# EAGLE design alimentadorV2 (EAGLE 6.6.0)
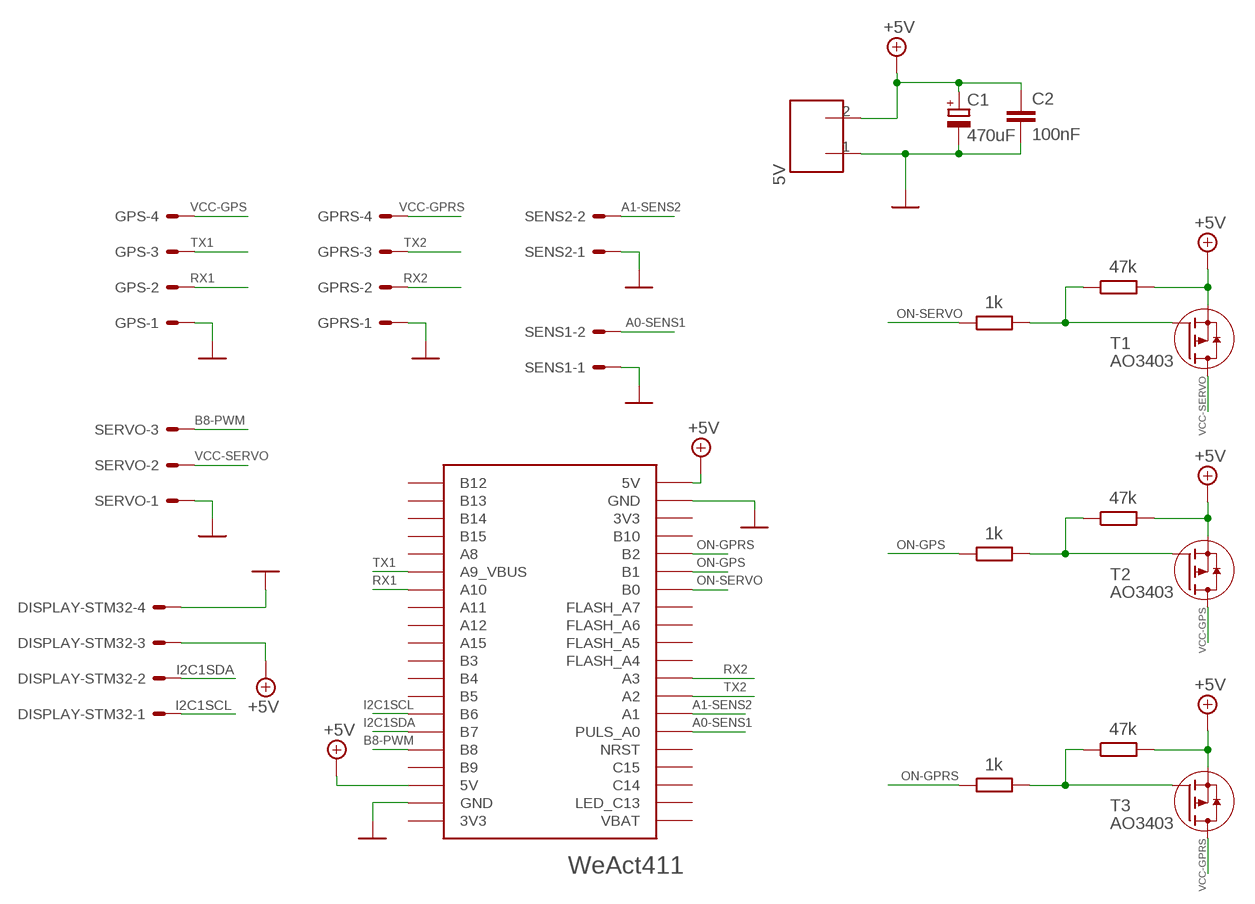
[diagram p0: schematic, sheet 1]

## Parts
5V  CONECTOR_2P-3.81  [CON2P-3.81]
C1  470uF  CPOL-EUE5-10.5  [E5-10,5]
C2  100nF  C-EUC1206  [C1206]
DISPLAY-STM32  22-05-7048-04  [7395-04]
GPRS  22-27-2041-04  [6410-04]
GPS  22-27-2041-04  [6410-04]
R1  47k  R-EU_R1206  [R1206]
R2  47k  R-EU_R1206  [R1206]
R3  1k  R-EU_R1206  [R1206]
R4  1k  R-EU_R1206  [R1206]
R5  47k  R-EU_R1206  [R1206]
R6  1k  R-EU_R1206  [R1206]
SENS1  22-27-2021-02  [6410-02]
SENS2  22-27-2021-02  [6410-02]
SERVO  22-27-2031-03  [6410-03]
T1  AO3403  [SOT23]
T2  AO3403  [SOT23]
T3  AO3403  [SOT23]
U$2  WEACT411  [WEACT411]

## Nets
+5V: 5V.2 C1.+ C2.1 DISPLAY-STM32.3 R1.2 R2.2 R5.2 T1.2(S) T2.2(S) T3.2(S) U$2.5V@1(5V) U$2.5V@2(5V)
A0-SENS1: SENS1.2 U$2.A0(PULS_A0)
A1-SENS2: SENS2.2 U$2.A1
B8-PWM: SERVO.3 U$2.B8
GND [pwr]: 5V.1 C1.- C2.2 DISPLAY-STM32.4 GPRS.1 GPS.1 SENS1.1 SENS2.1 SERVO.1 U$2.GND@1(GND) U$2.GND@2(GND)
I2C1SCL: DISPLAY-STM32.1 U$2.B6
I2C1SDA: DISPLAY-STM32.2 U$2.B7
N$2: R2.1 R3.2 T1.1(G)
N$5: R1.1 R4.2 T2.1(G)
N$8: R5.1 R6.2 T3.1(G)
ON-GPRS: R6.1 U$2.B2
ON-GPS: R4.1 U$2.B1
ON-SERVO: R3.1 U$2.B0
RX1: GPS.2 U$2.A10
RX2: GPRS.2 U$2.A3
TX1: GPS.3 U$2.A9(A9_VBUS)
TX2: GPRS.3 U$2.A2
VCC-GPRS: GPRS.4 T3.3(D)
VCC-GPS: GPS.4 T2.3(D)
VCC-SERVO: SERVO.2 T1.3(D)
Unconnected: U$2.3V3@1(3V3) U$2.3V3@2(3V3) U$2.A4(FLASH_A4) U$2.A5(FLASH_A5) U$2.A6(FLASH_A6) U$2.A7(FLASH_A7) U$2.A8 U$2.A11 U$2.A12 U$2.A15 U$2.B3 U$2.B4 U$2.B5 U$2.B9 U$2.B10 U$2.B12 U$2.B13 U$2.B14 U$2.B15 U$2.C13(LED_C13) U$2.C14 U$2.C15 U$2.NRST U$2.VBAT

## Library data of the parts
5V = jcf:CONECTOR_2P-3.81
C1 = rcl:CPOL-EU: POLARIZED CAPACITOR, European symbol
C2 = rcl:C-EU: CAPACITOR, European symbol
DISPLAY-STM32 GPRS GPS = con-molex:22-?-04: CONNECTOR wire to board 2.54 mm (.1 inch) pitch header; OC_FARNELL: unknown; OC_NEWARK: unknown
R1-R6 = rcl:R-EU_: RESISTOR, European symbol
SENS1 SENS2 = con-molex:22-?-02: CONNECTOR wire to board 2.54 mm (.1 inch) pitch header; OC_FARNELL: unknown; OC_NEWARK: unknown
SERVO = con-molex:22-?-03: CONNECTOR wire to board 2.54 mm (.1 inch) pitch header; OC_FARNELL: unknown; OC_NEWARK: unknown
T1-T3 = jcf:AO3403: AO3403 P-channel MOSFET 2.6A 30V
U$2 = jcf:WEACT411: WeAct STM32F411

## Net classes
0 default: width 0.241 mm, drill 0.584 mm, clearance 0.241 mm
1 pwr: width 0.25 mm

## Board
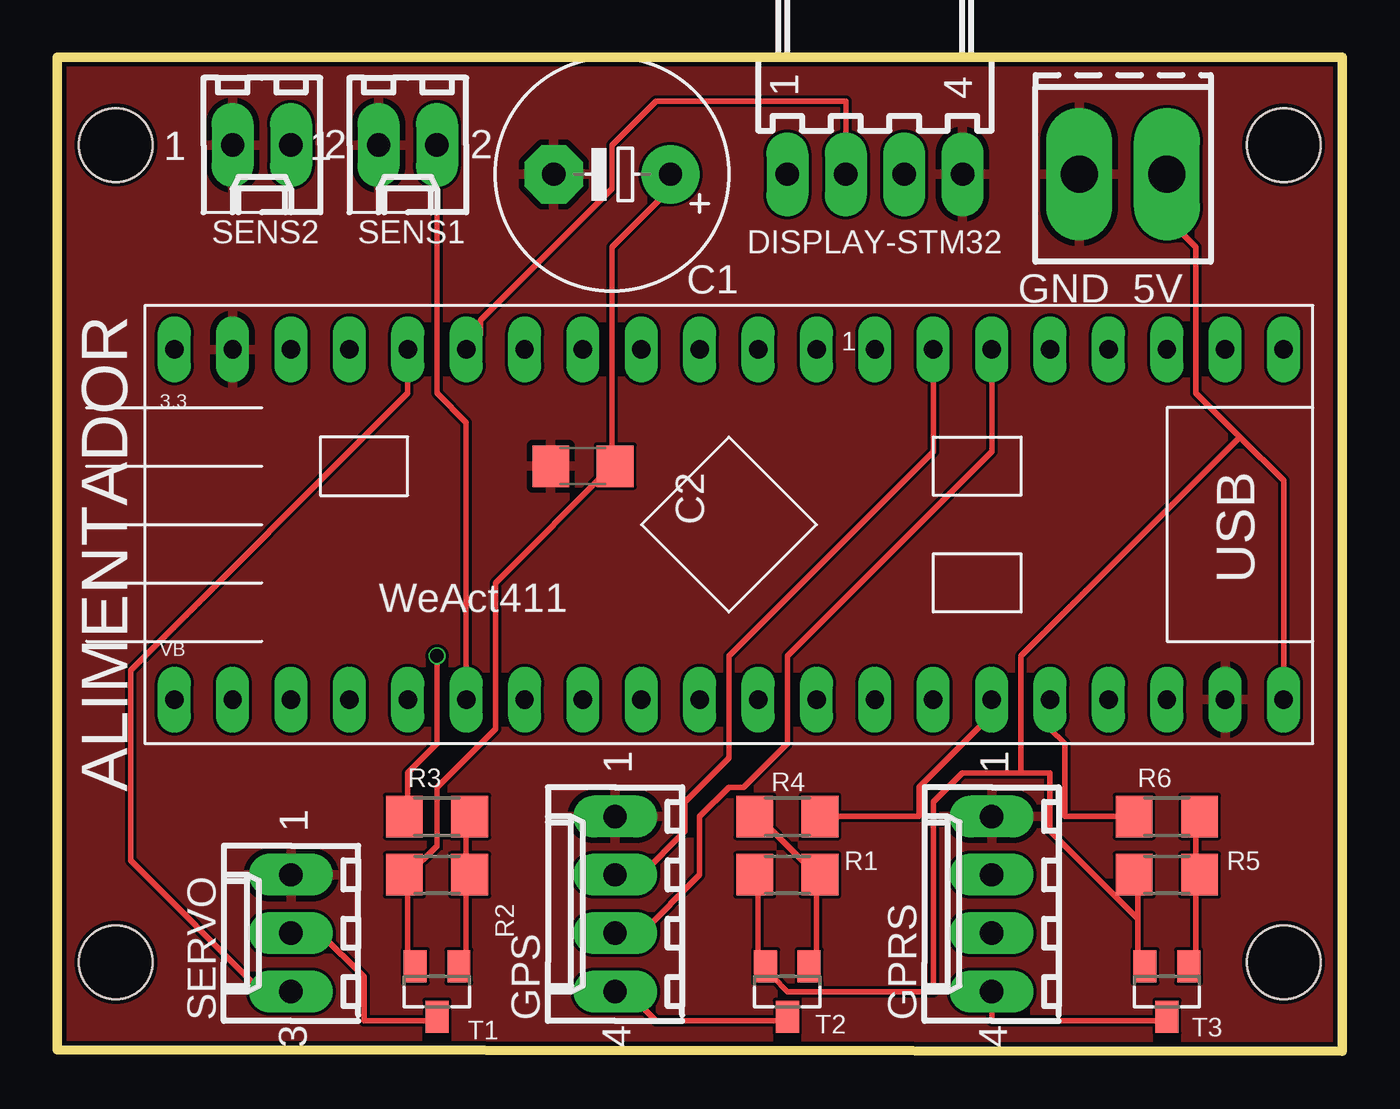
[diagram p1: board, top side]
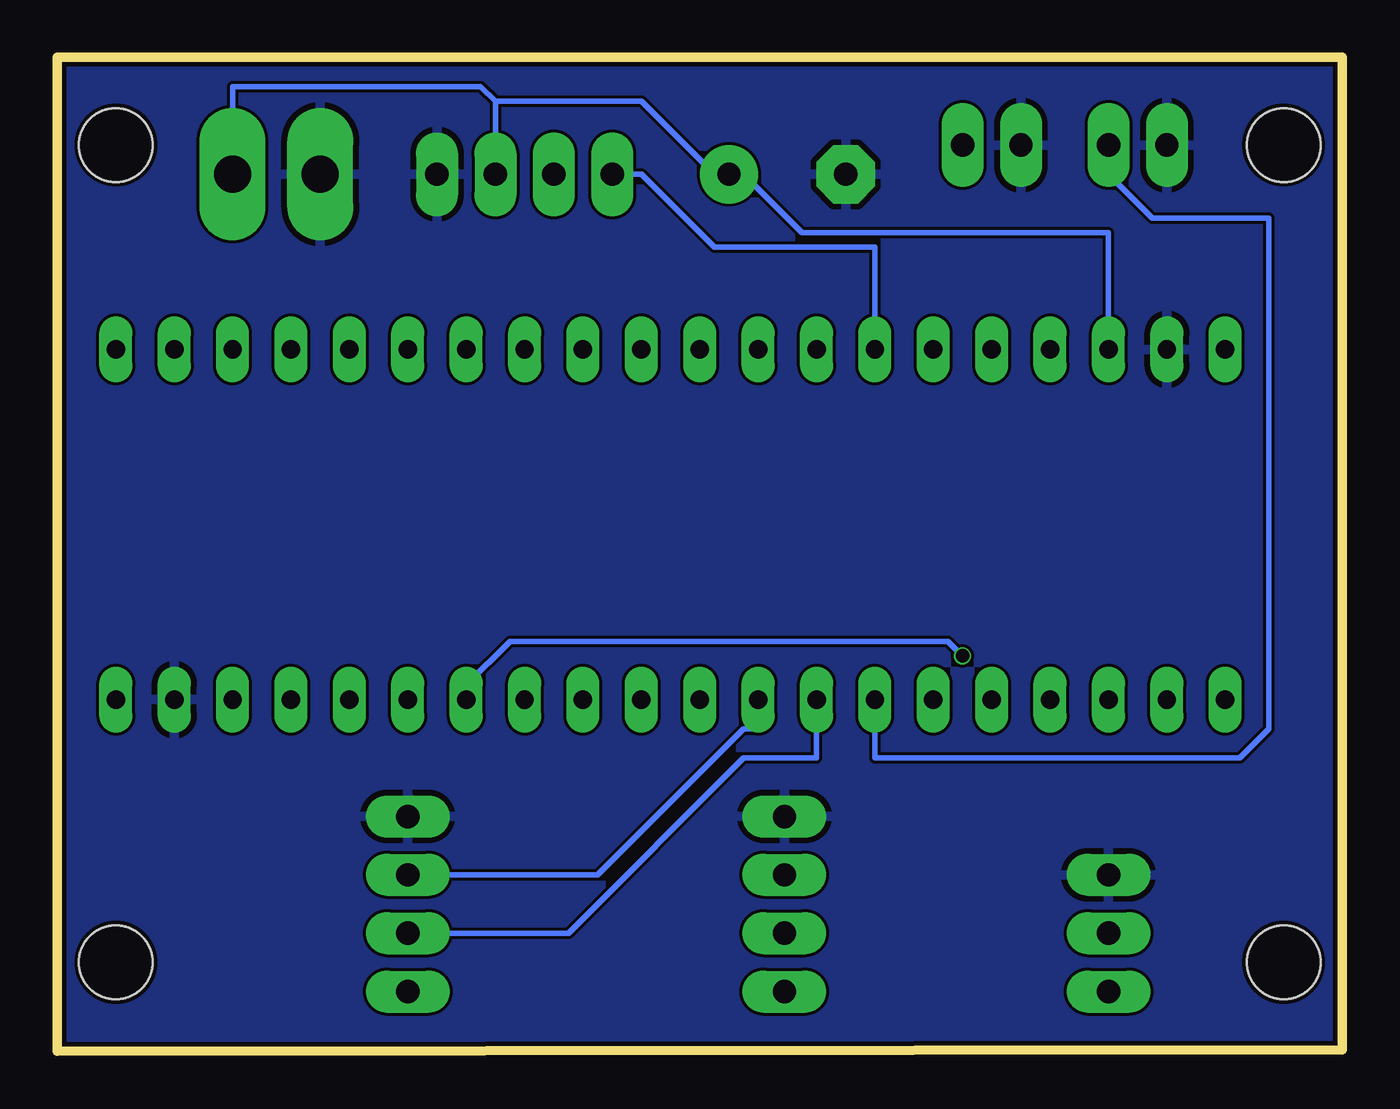
[diagram p2: board, bottom side, seen from below]

Size 55.88 x 43.23 mm. Coordinates in mm from the lower left corner, seen from the top.
Outline: 0,43.23 0,0.05 55.88,0 55.88,43.23 0,43.23
Copper layers (1*16): Top 0.035mm / dielectric 1.6mm / Bottom 0.035mm
Design rules "jlcpcb-2layers": minimum track width 5mil, minimum drill 0.3mm, track to track 5mil, track to pad 5mil, pad to pad 5mil, via to via 5mil, smd to smd 5mil, copper to edge 0.2mm, drill to drill 6mil, minimum pad ring 10mil, minimum via ring 3mil, stop-mask expansion 4mil, vias tented up to drill 0mil, thermal gap 10mil
Holes 3.2 mm at 53.34,3.86 2.54,3.86 53.34,39.42 2.54,39.42

### Footprints (pad centres in the part's own frame; a part is rotated, then mirrored left to right if it is on the bottom)
CON2P-3.81 = drill 1.6 long: 1 0,0; 2 3.81,0
E5-10,5 = drill 1.016 pad 2.54: + -2.54,0 | drill 1.016 pad 2.54 octagon: - 2.54,0
C1206 = smd 1.6 x 1.8: 1 -1.4,0; 2 1.4,0
7395-04 = drill 1.016 long: 1 3.81,0; 2 1.27,0; 3 -1.27,0; 4 -3.81,0
6410-04 = drill 1.016 long: 1 3.81,0; 2 1.27,0; 3 -1.27,0; 4 -3.81,0
R1206 = smd 1.6 x 1.803: 1 -1.422,0; 2 1.422,0
6410-02 = drill 1.016 long: 1 1.27,0; 2 -1.27,0
6410-03 = drill 1.016 long: 1 2.54,0; 2 0,0; 3 -2.54,0
SOT23 = smd 1 x 1.4: 1 -0.95,-1.1; 2 0.95,-1.1; 3 0,1.1
WEACT411 = drill 0.8 long: 3V3@1 43.18,0; 3V3@2 0,15.24; 5V@1 48.26,0; 5V@2 5.08,15.24; A0 12.7,0; A1 15.24,0; A2 17.78,0; A3 20.32,0; A4 22.86,0; A5 25.4,0; A6 27.94,0; A7 30.48,0; A8 38.1,15.24; A9 35.56,15.24; A10 33.02,15.24; A11 30.48,15.24; A12 27.94,15.24; A15 25.4,15.24; B0 33.02,0; B1 35.56,0; B2 38.1,0; B3 22.86,15.24; B4 20.32,15.24; B5 17.78,15.24; B6 15.24,15.24; B7 12.7,15.24; B8 10.16,15.24; B9 7.62,15.24; B10 40.64,0; B12 48.26,15.24; B13 45.72,15.24; B14 43.18,15.24; B15 40.64,15.24; C13 2.54,0; C14 5.08,0; C15 7.62,0; GND@1 45.72,0; GND@2 2.54,15.24; NRST 10.16,0; VBAT 0,0

### Placement (x,y rotation side)
5V  44.45,38.15 0 top
C1  24.13,38.15 180 top
C2  22.86,25.45 180 top
DISPLAY-STM32  35.56,38.15 180 top
GPRS  40.64,6.4 90 top
GPS  24.26,6.4 90 top
R1  31.75,7.67 180 top
R2  16.51,7.67 180 top
R3  16.51,10.21 0 top
R4  31.75,10.21 180 top
R5  48.26,7.67 180 top
R6  48.26,10.21 0 top
SENS1  15.24,39.42 180 top
SENS2  8.89,39.42 180 top
SERVO  10.16,5.13 90 top
T1  16.51,2.59 180 top
T2  31.75,2.59 180 top
T3  48.26,2.59 180 top
U$2  5.08,15.29 0 top

### Tracks (layer width: path | path; a pad name or v marks a point on that pad's centre or on a via)
+5V
  Top 0.241: U$2.5V@1 53.34,24.82 51.44,26.72 | 51.44,26.72 49.53,28.63 49.53,34.98 48.26,36.25 5V.2 | 24.13,25.45 24.13,34.98 26.67,37.52 C1.+ | 15.24,7.67 15.24,3.86 T1.2 | R1.2 30.48,7.67 30.48,3.86 T2.2 31.11,3.23 31.75,2.59 38.1,2.59 38.1,10.85 39.37,12.12 41.91,12.12 | 46.99,5.77 46.99,7.67 R5.2 | 46.99,5.77 46.99,3.86 T3.2 | 41.91,12.12 43.18,12.12 43.18,9.58 46.99,5.77 | 15.24,7.67 16.51,8.94 16.51,11.48 19.05,14.02 19.05,20.37 24.13,25.45 | 15.24,7.67 R2.2 | 24.13,25.45 C2.1 | 41.91,12.12 41.91,17.2 51.44,26.72
  Bottom 0.241: U$2.5V@2 10.16,35.61 23.49,35.61 26.04,38.15 C1.+ 27.3,38.15 30.48,41.33 36.83,41.33 | 36.83,41.33 DISPLAY-STM32.3 | 5V.2 48.26,41.96 37.46,41.96 36.83,41.33
A0-SENS1
  Top 0.241: U$2.A0 17.78,27.36 16.51,28.63 SENS1.2
A1-SENS2
  Bottom 0.241: U$2.A1 20.32,12.75 4.45,12.75 3.17,14.02 3.17,36.25 8.25,36.25 10.16,38.15 SENS2.2
B8-PWM
  Top 0.241: U$2.B8 15.24,28.63 3.17,16.56 3.17,8.31 8.89,2.59 SERVO.3
GND
  pour Bottom: 0,0.05 55.88,0.03 55.88,43.23 0,43.23
  pour Top: 0,43.23 55.88,43.23 55.88,0.03 0,0.05
I2C1SCL
  Bottom 0.241: U$2.B6 20.32,34.98 27.3,34.98 30.48,38.15 DISPLAY-STM32.1
I2C1SDA
  Top 0.241: U$2.B7 18.41,31.17 18.41,31.8 24.13,37.52 24.13,39.42 26.04,41.33 34.29,41.33 DISPLAY-STM32.2
N$2
  Top 0.241: 17.78,7.67 17.78,3.86 T1.1 | 17.78,7.67 17.78,10.21 R3.2 | 17.78,7.67 R2.1
N$5
  Top 0.241: 33.02,7.67 33.02,3.86 T2.1 | 33.02,7.67 30.48,10.21 R4.2 | 33.02,7.67 R1.1
N$8
  Top 0.241: 49.53,7.67 49.53,3.86 T3.1 | 49.53,7.67 49.53,10.21 R6.2 | 49.53,7.67 R5.1
ON-GPRS
  Top 0.241: R6.1 43.81,10.21 43.81,13.39 43.18,14.02 U$2.B2
ON-GPS
  Top 0.241: R4.1 37.46,10.21 37.46,11.48 40.64,14.66 U$2.B1
ON-SERVO  (via drill 0.58)
  Top 0.241: v16.51,17.2 16.51,13.39 15.24,12.12 15.24,10.21 R3.1
  Bottom 0.241: v16.51,17.2 17.14,17.83 36.2,17.83 38.1,15.93 U$2.B0
RX1
  Top 0.241: U$2.A10 38.1,26.09 29.21,17.2 29.21,12.75 27.3,10.85 27.3,9.58 25.4,7.67 GPS.2
RX2
  Bottom 0.241: U$2.A3 25.4,14.02 26.04,14.02 32.38,7.67 GPRS.2
TX1
  Top 0.241: U$2.A9 40.64,26.09 31.75,17.2 31.75,13.39 29.84,11.48 29.21,11.48 27.94,10.21 27.94,7.67 25.4,5.13 GPS.3
TX2
  Bottom 0.241: U$2.A2 22.86,12.75 26.04,12.75 33.66,5.13 GPRS.3
VCC-GPRS
  Top 0.241: GPRS.4 40.64,1.32 48.26,1.32 T3.3
VCC-GPS
  Top 0.241: T2.3 31.75,1.32 26.04,1.32 24.77,2.59 GPS.4
VCC-SERVO
  Top 0.241: SERVO.2 11.43,5.13 13.34,3.23 13.34,1.32 16.51,1.32 T1.3

### Text on the board
tPlace: GND 5V
tNames: 1 | ALIMENTADOR